# EasyEDA schematic SCH_Gantry-Sensor-PCB-SMD_2024-09-11.json
TITLE: Sheet_1; REV: 1.0; Date: 2022-06-12; Sheet: 1/1; Drawn By: Edward Niedziejko; Company: Your Company
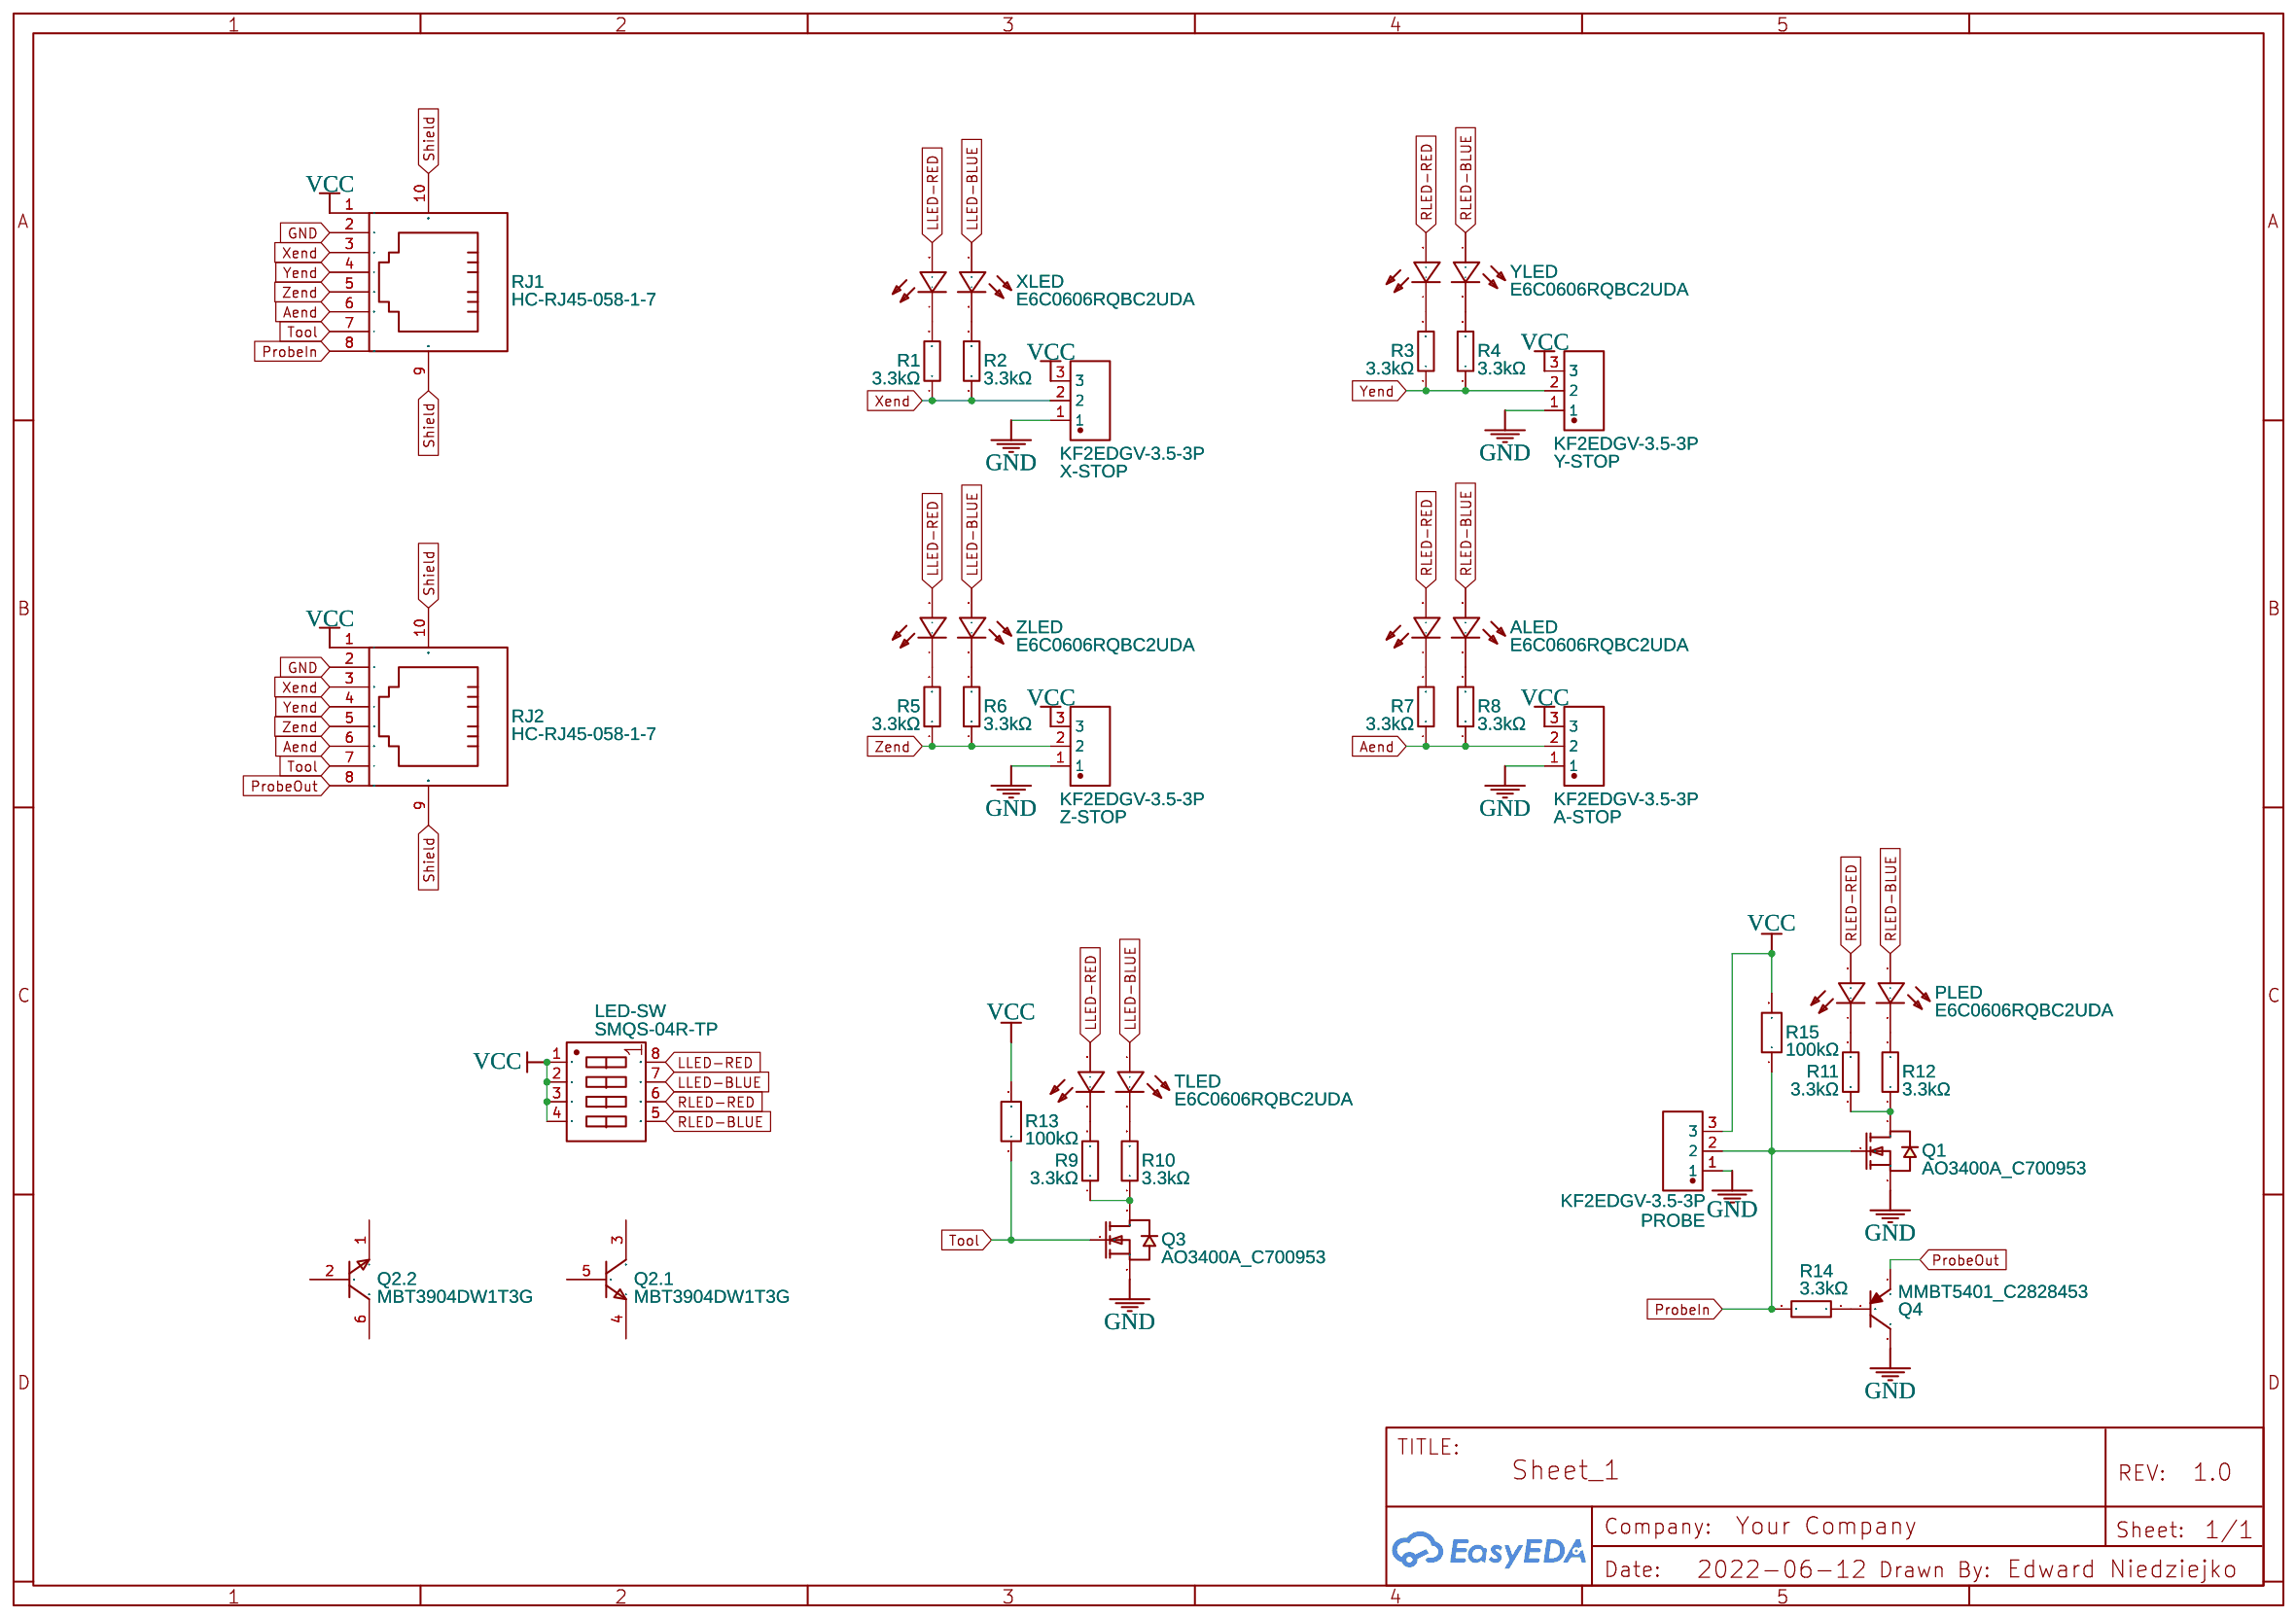
[diagram p0: schematic sheet]

## Parts
A-STOP  KF2EDGV-3.5-3P  [CONN-TH_3P-P3.50_KF2EDGV-3.5-3P]
ALED  E6C0606RQBC2UDA  [LED-ARRAY-SMD_4P-L1.6-W1.6-P0.90-BR-RD]
LED-SW  SMQS-04R-TP  [SW-TH_8P-P2.54_SMQS-04R-TP]
PLED  E6C0606RQBC2UDA  [LED-ARRAY-SMD_4P-L1.6-W1.6-P0.90-BR-RD]
PROBE  KF2EDGV-3.5-3P  [CONN-TH_3P-P3.50_KF2EDGV-3.5-3P]
Q1  AO3400A_C700953  [SOT-23-3_L2.9-W1.3-P1.90-LS2.4-BR]
Q2  MBT3904DW1T3G  [ONSC-SOT-363-6-419B-02_W_V]  (sections 1,2)
Q3  AO3400A_C700953  [SOT-23-3_L2.9-W1.3-P1.90-LS2.4-BR]
Q4  MMBT5401_C2828453  [SOT-23-3_L2.9-W1.4-P1.90-LS2.4-TR]
R1  3.3kΩ  [R0402]
R2  3.3kΩ  [R0402]
R3  3.3kΩ  [R0402]
R4  3.3kΩ  [R0402]
R5  3.3kΩ  [R0402]
R6  3.3kΩ  [R0402]
R7  3.3kΩ  [R0402]
R8  3.3kΩ  [R0402]
R9  3.3kΩ  [R0402]
R10  3.3kΩ  [R0402]
R11  3.3kΩ  [R0402]
R12  3.3kΩ  [R0402]
R13  100kΩ  [R0402]
R14  3.3kΩ  [R0402]
R15  100kΩ  [R0402]
RJ1  HC-RJ45-058-1-7  [RJ45-TH_HC-RJ45-058-1-7]
RJ2  HC-RJ45-058-1-7  [RJ45-TH_HC-RJ45-058-1-7]
TLED  E6C0606RQBC2UDA  [LED-ARRAY-SMD_4P-L1.6-W1.6-P0.90-BR-RD]
X-STOP  KF2EDGV-3.5-3P  [CONN-TH_3P-P3.50_KF2EDGV-3.5-3P]
XLED  E6C0606RQBC2UDA  [LED-ARRAY-SMD_4P-L1.6-W1.6-P0.90-BR-RD]
Y-STOP  KF2EDGV-3.5-3P  [CONN-TH_3P-P3.50_KF2EDGV-3.5-3P]
YLED  E6C0606RQBC2UDA  [LED-ARRAY-SMD_4P-L1.6-W1.6-P0.90-BR-RD]
Z-STOP  KF2EDGV-3.5-3P  [CONN-TH_3P-P3.50_KF2EDGV-3.5-3P]
ZLED  E6C0606RQBC2UDA  [LED-ARRAY-SMD_4P-L1.6-W1.6-P0.90-BR-RD]

## Library data of the parts
A-STOP PROBE X-STOP Y-STOP Z-STOP = KF2EDGV-3.5-3P: Supplier: LCSC; Supplier Part: C441322; Manufacturer: Cixi Kefa Elec; Contributor: LCSC; JLCPCB Part Class: Extended Part
ALED PLED TLED XLED YLED ZLED = E6C0606RQBC2UDA: Contributor: LCSC; Supplier: LCSC; Supplier Part: C375544; Manufacturer: ekinglux(亿晶源); JLCPCB Part Class: Extended Part
LED-SW = SMQS-04R-TP: Supplier: LCSC; Supplier Part: C5299505; Manufacturer: SM Switch; JLCPCB Part Class: Extended Part; Contributor: lcsc
Q1 Q3 = AO3400A_C700953: Contributor: LCSC; Supplier: LCSC; Supplier Part: C700953; Manufacturer: HUASHUO(华朔); Manufacturer Part: AO3400A; JLCPCB Part Class: Extended Part
Q2 = MBT3904DW1T3G: Dual General Purpose Transistors, 6-Pin SOT-363, Pb-Free, Tape and Reel; subpart_no: 1
Q4 = MMBT5401_C2828453: Contributor: LCSC; Supplier: LCSC; Supplier Part: C2828453; Manufacturer: CBI(创基); Manufacturer Part: MMBT5401 2L; JLCPCB Part Class: Extended Part
R1-R12 R14 = CR0402FF3301G: Supplier: LCSC; Manufacturer: LIZ(丽智电子); Supplier Part: C100376; JLCPCB Part Class: Extended Part
R13 R15 = SCR0402F100K: Contributor: lcsc; Supplier: LCSC; Supplier Part: C3015887; Manufacturer: VO(翔胜); JLCPCB Part Class: Extended Part
RJ1 RJ2 = HC-RJ45-058-1-7: Supplier: LCSC; Supplier Part: C5777774; Manufacturer: HCTL(华灿天禄); Contributor: lcsc; JLCPCB Part Class: Extended Part

## Nets
GND: A-STOP.1 PROBE.1 Q1.2(S) Q3.2(S) Q4.3(C) RJ1.2 RJ2.2 X-STOP.1 Y-STOP.1 Z-STOP.1
VCC: A-STOP.3 LED-SW.1(PIN1) LED-SW.2(PIN2) LED-SW.3(PIN3) LED-SW.4(PIN4) PROBE.3 R13.2 R15.2 RJ1.1 RJ2.1 X-STOP.3 Y-STOP.3 Z-STOP.3
Aend: A-STOP.2 R7.1 R8.1 RJ1.6 RJ2.6
LLED-BLUE: LED-SW.7(PIN7) TLED.1(+) XLED.1(+) ZLED.1(+)
LLED-RED: LED-SW.8(PIN8) TLED.3(+) XLED.3(+) ZLED.3(+)
ProbeIn: PROBE.2 Q1.1(G) R14.2 R15.1 RJ1.8
ProbeOut: Q4.1(E) RJ2.8
RLED-BLUE: ALED.1(+) LED-SW.5(PIN5) PLED.1(+) YLED.1(+)
RLED-RED: ALED.3(+) LED-SW.6(PIN6) PLED.3(+) YLED.3(+)
Shield: RJ1.9(SHELL) RJ1.10(SHELL) RJ2.9(SHELL) RJ2.10(SHELL)
Tool: Q3.1(G) R13.1 RJ1.7 RJ2.7
Xend: R1.1 R2.1 RJ1.3 RJ2.3 X-STOP.2
Yend: R3.1 R4.1 RJ1.4 RJ2.4 Y-STOP.2
Zend: R5.1 R6.1 RJ1.5 RJ2.5 Z-STOP.2
Net-(ALED-2): ALED.2(-) R8.2
Net-(ALED-4): ALED.4(-) R7.2
Net-(PLED-2): PLED.2(-) R12.2
Net-(PLED-4): PLED.4(-) R11.2
Net-(Q1-3): Q1.3(D) R11.1 R12.1
Net-(Q3-3): Q3.3(D) R9.1 R10.1
Net-(Q4-2): Q4.2(B) R14.1
Net-(R1-2): R1.2 XLED.4(-)
Net-(R2-2): R2.2 XLED.2(-)
Net-(R3-2): R3.2 YLED.4(-)
Net-(R4-2): R4.2 YLED.2(-)
Net-(R5-2): R5.2 ZLED.4(-)
Net-(R6-2): R6.2 ZLED.2(-)
Net-(R9-2): R9.2 TLED.4(-)
Net-(R10-2): R10.2 TLED.2(-)

Not connected (* = marked no-connect by the designer): Q2 1(E) 2(B) 3(C) 4(E) 5(B) 6(C)
